# Altium schematic sheet Power Manangement.SchDoc
size A3; SheetNumber: 3; SheetTotal: 5
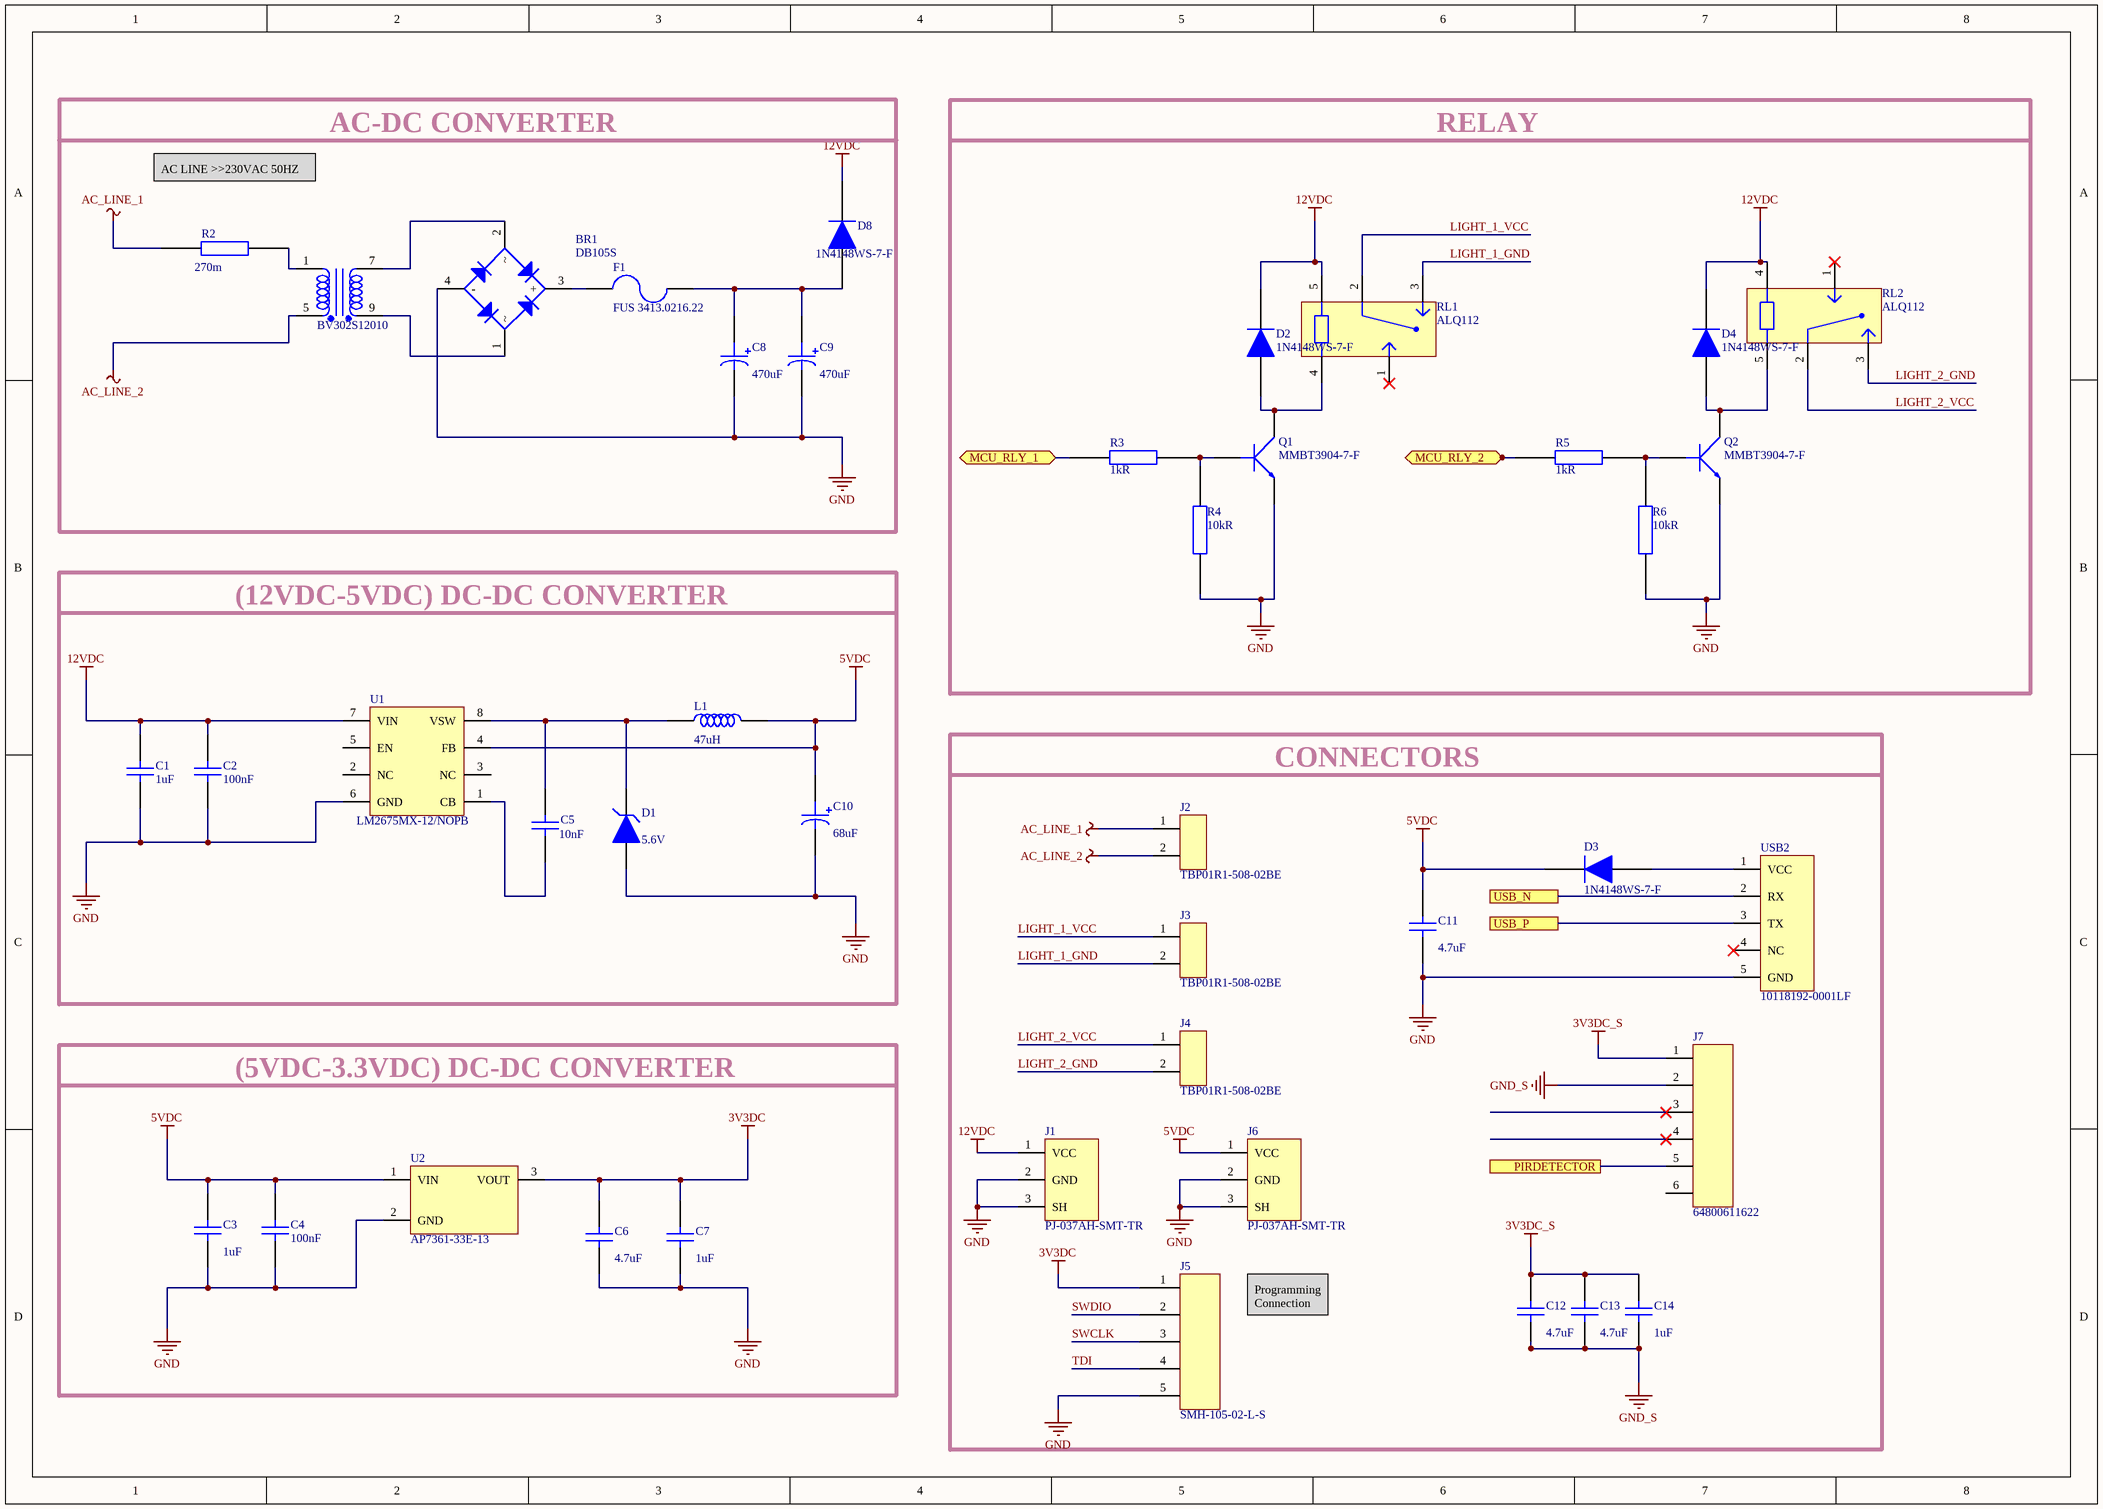
[diagram p0: Power Manangement.SchDoc]

## Parts
?  BV302S12010  [BV302S12010]
BR1  DB105S  [DB105S]
C1  value 1uF  [CAP_0805]  (hidden comment: CL21B105KBFNNNE)
C2  value 100nF  [CAP_0603]  (hidden comment: C0603C104K5RAC7867)
C3  value 1uF  [CAP_0805]  (hidden comment: CL21B105KBFNNNE)
C4  value 100nF  [CAP_0603]  (hidden comment: C0603C104K5RAC7867)
C5  Values: 10nF  [CAP_0603]  (hidden comment: 0603B103K160CT)
C6  value 4.7uF  [CAP_0805]  (hidden comment: CL21A475KAQNNNE)
C7  value 1uF  [CAP_0805]  (hidden comment: CL21B105KBFNNNE)
C8  Capacitance: 470uF  [CAP_RADIAL_D10_P5]  (hidden comment: ESH477M050AH4AA)
C9  Capacitance: 470uF  [CAP_RADIAL_D10_P5]  (hidden comment: ESH477M050AH4AA)
C10  Values: 68uF  [CAP_EEVSRIES]  (hidden comment: EEV686M035A9HAA)
C11  value 4.7uF  [CAP_0805]  (hidden comment: CL21A475KAQNNNE)
C12  value 4.7uF  [CAP_0805]  (hidden comment: CL21A475KAQNNNE)
C13  value 4.7uF  [CAP_0805]  (hidden comment: CL21A475KAQNNNE)
C14  value 1uF  [CAP_0805]  (hidden comment: CL21B105KBFNNNE)
D1  Voltage Rating (DC): 5.6V  [SMB]  (hidden comment: 1SMB5919BT3G)
D2  1N4148WS-7-F  [SOD323F]
D3  1N4148WS-7-F  [SOD323F]
D4  1N4148WS-7-F  [SOD323F]
D8  1N4148WS-7-F  [SOD323F]
F1  FUS 3413.0216.22  [FUS 3413.0216.22]
J1  PJ-037AH-SMT-TR  [JACK]
J2  TBP01R1-508-02BE  [TBP01R1-508]
J3  TBP01R1-508-02BE  [TBP01R1-508]
J4  TBP01R1-508-02BE  [TBP01R1-508]
J5  SMH-105-02-L-S  [INHEADER1X5_RA]
J6  PJ-037AH-SMT-TR  [JACK]
J7  64800611622
L1  value 47uH  [IND_1212]  (hidden comment: 78438335470)
Q1  MMBT3904-7-F  [SOT-23F]
Q2  MMBT3904-7-F  [SOT-23F]
R2  Resistance: 270m  [RES_AXIAL_W]  (hidden comment: 5WD27)
R3  value 1kR  [RES_0603]  (hidden comment: RC0603FR-0710KL)
R4  value 10kR  [RES_0603]  (hidden comment: RMCF0603JT10K0)
R5  value 1kR  [RES_0603]  (hidden comment: RC0603FR-0710KL)
R6  value 10kR  [RES_0603]  (hidden comment: RMCF0603JT10K0)
RL1  ALQ112  [ALQ112]
RL2  ALQ112  [ALQ112]
U1  LM2675MX-12/NOPB  [SOIC8]
U2  AP7361-33E-13  [SOT223]
USB2  10118192-0001LF  [MICRO_B_USB]

## Blocks framed on the sheet
RELAY: D2 D4 Q1 Q2 R3-R6 RL1 RL2
(12VDC-5VDC) DC-DC CONVERTER: C1 C2 C5 C10 D1 L1 U1
CONNECTORS: C11-C14 D3 J1-J7 USB2
(5VDC-3.3VDC) DC-DC CONVERTER: C3 C4 C6 C7 U2

## Ports
MCU_RLY_1 (bidir, see Microcontroller[3B]), MCU_RLY_2 (bidir, see Microcontroller[3B]), PIRDETECTOR (see Microcontroller[3B], Sensor Board[4B], Sensor Board[6A], Sensor Board[7A]), USB_N (see Microcontroller[4A]), USB_P (see Microcontroller[4A])

## Nets
3V3DC: C6.2 C7.1 J5.1 U2.3(VOUT)
3V3DC_S: C12.2 C13.2 C14.2 J7.1
5VDC: C3.1 C4.2 C10.1 C11.2 D3.1 J6.1(VCC) L1.2 U1.4(FB) U2.1(VIN)
12VDC: C1.1 C2.2 D2.1 D4.1 D8.1 J1.1(VCC) RL1.5 RL2.4 U1.7(VIN)
AC_LINE_1: J2.1 R2.1
AC_LINE_2: ?.5 J2.2
GND: BR1.4(-) C1.2 C2.1 C3.2 C4.1 C6.1 C7.2 C8.2 C9.2 C10.2 C11.1 D1.A J1.2(GND) J1.3(SH) J5.5 J6.2(GND) J6.3(SH) Q1.2(E) Q2.2(E) R4.1 R6.1 U1.6(GND) U2.2(GND) USB2.5(GND)
GND_S: C12.1 C13.1 C14.1 J7.2
LIGHT_1_GND: J3.2 RL1.3
LIGHT_1_VCC: J3.1 RL1.2
LIGHT_2_GND: J4.2 RL2.3
LIGHT_2_VCC: J4.1 RL2.2
MCU_RLY_1: R3.2 ; port MCU_RLY_1
MCU_RLY_2: R5.2 ; port MCU_RLY_2
PIRDETECTOR: J7.5 ; port PIRDETECTOR
SWCLK: J5.3
SWDIO: J5.2
TDI: J5.4
USB_N: USB2.2(RX) ; port USB_N
USB_P: USB2.3(TX) ; port USB_P
Net?_1: ?.1 R2.2
Net?_7: ?.7 BR1.2
Net?_9: ?.9 BR1.1
NetBR1_3: BR1.3(+) F1.1
NetC5_1: C5.1 U1.1(CB)
NetC5_2: C5.2 D1.C L1.1 U1.8(VSW)
NetC8_1: C8.1 C9.1 D8.2 F1.2
NetD2_2: D2.2 Q1.3(C) RL1.4
NetD3_2: D3.2 USB2.1(VCC)
NetD4_2: D4.2 Q2.3(C) RL2.5
NetQ1_1: Q1.1(B) R3.1 R4.2
NetQ2_1: Q2.1(B) R5.1 R6.2

Not connected (* = marked no-connect by the designer): J7 3* 4* 6; RL1 1*; RL2 1*; U1 2(NC) 3(NC) 5(EN); USB2 4(NC)*

## Notes on the sheet
- AC LINE >>230VAC 50HZ
- AC-DC CONVERTER
- Programming Connection

## Library data of the parts
? = BV302S12010: Sealed Transformer EI30/10.5; Manufacturer: Zettler Magnetics; Designed by: Selenay; Supplier: Digikey; Supplier Part Number: 3388-BV302S12010-ND; Manufacturer Part Number: BV302S12010; RoHS: No; Category: Uncategorized; Stock: 995; Pricing: 1=2,97, 15=2,37533, 30=1,93, 60=1,88067, 105=1,83114, 255=1,78165, 510=1,76678, 1005=1,56388, 5010=1,43521 (USD); RoHS Compliant: No
BR1 = DB105STR: Bridge Rect 1PHASE 600V 1A Db-s; Manufacturer: Sangdest Microelectronics; Designed by: Selenay; Supplier: Digikey; Supplier Part Number: 1655-DB105SCT-ND; Manufacturer Part Number: DB105S; RoHS: No; Category: Uncategorized; Stock: 12577; Pricing: 1=0,41, 10=0,29, 100=0,1464, 500=0,12978 (USD)
C1 C3 C7 C14 = CAP CER 1uF 0805: Multilayer Ceramic Capacitor, 1 uF, 50 V, ± 10%, X7R, 0805 [2012 Metric]; Manufacturer: Samsung; Voltage Rating (DC): 50V; Designed By: Selenay; Supplier: Digikey; Supplier Part Number: 1276-1029-1-ND; Manufacturer Part Number: CL21B105KBFNNNE; RoHS: Yes; Category: Ceramic Capacitors; Stock: 1263322; Pricing: 1=0,11, 10=0,075, 50=0,045, 100=0,0354, 500=0,02616, 1000=0,02165 (USD); Mounting Technology: Surface Mount; Case/Package: 0805; Material: Ceramic; Case Code (Metric): 2012; Case Code (Imperial): 0805; Min Operating Temperature: -55°C; Max Operating Temperature: 125°C; Tolerance: 10%; Packaging: Tape and Reel; Package Quantity: 1; Voltage Rating: 50V; Dielectric: X7R; Voltage: 50V; Series: CL; Construction: Flat; Length: 2mm; Width: 0.049inch; Height: 1.25mm; Thickness: 0.053inch; Depth: 1.25mm; Radiation Hardening: No; RoHS Compliant: Yes; ComponentLink1URL: https://datasheet.ciiva.com/25800/cl21b105kbfnnne-25800291.pdf?src-supplier=Digikey; ComponentLink1Description: https://datasheet.ciiva.com/25800/cl21b105kbfnnne-25800291.pdf?src-supplier=Digikey
C2 C4 = CAP CER 100nF 0603: Multilayer Ceramic Capacitor, 0.1 uF, 50 V, ± 10%, X7R, 0603 [1608 Metric]; Manufacturer: KEMET; Manufacturer Part Number: C0603C104K5RACTU; Designed by: Selenay; Material: 4241ConductorMaterial; Voltage Rating: 50V; Temperature Coefficient: 30ppm/°C; Supplier: Digikey; Supplier Part Number: 399-C0603C104K5RAC7867CT-ND; RoHS: Yes; Category: Ceramic Capacitors; Stock: 2150274; Pricing: 1=0,11, 10=0,074, 50=0,0424, 100=0,0329, 500=0,02474, 1000=0,01944 (USD); Mounting Technology: Surface Mount; Case/Package: 0603; Min Operating Temperature: -55°C; Max Operating Temperature: 125°C; Tolerance: 10%; Dielectric: X7R; Packaging: Tape and Reel; Voltage: 50V; Series: SMD Comm X7R; Length: 0.063inch; Width: 0.031inch; Thickness: 0.034inch; RoHS Compliant: Yes; Lead Free: 5697LeadFree
C5 = CAP CER 10nF 0603: 0603 16V X7R .01uF 10% multilayer ceramic capacitor; Manufacturer: Walsin Technologies; Designed By: Selenay; Supplier: Digikey; Supplier Part Number: 1292-1384-1-ND; Manufacturer Part Number: 0603B103K160CT; RoHS: Yes; Category: Ceramic Capacitors; Stock: 66698; Pricing: 1=0,1, 10=0,031, 50=0,018, 100=0,0139, 500=0,0105, 1000=0,00825 (USD); Lead Free: 5697LeadFree; ComponentLink1URL: http://www.farnell.com/datasheets/1958513.pdf?src-supplier=Farnell; ComponentLink1Description: http://www.farnell.com/datasheets/1958513.pdf?src-supplier=Farnell; ComponentLink2URL: https://datasheet.octopart.com/0603B103K160CT-Walsin-Technologies-datasheet-136037192.pdf?src-supplier=Future+Electronics; ComponentLink2Description: https://datasheet.octopart.com/0603B103K160CT-Walsin-Technologies-datasheet-136037192.pdf?src-supplier=Future+Electronics; ComponentLink3URL: http://www.passivecomponent.com/wp-content/uploads/2018/10/MLCC.pdf?src-supplier=Digikey; ComponentLink3Description: http://www.passivecomponent.com/wp-content/uploads/2018/10/MLCC.pdf?src-supplier=Digikey; ComponentLink4URL: https://datasheet.octopart.com/0603B103K160CT-Walsin-Technologies-datasheet-85392065.pdf?src-supplier=Element14; ComponentLink4Description: https://datasheet.octopart.com/0603B103K160CT-Walsin-Technologies-datasheet-85392065.pdf?src-supplier=Element14; ComponentLink5URL: https://datasheet.octopart.com/0603B103K160CT-Walsin-Technologies-datasheet-62066062.pdf?src-supplier=TME; ComponentLink5Description: https://datasheet.octopart.com/0603B103K160CT-Walsin-Technologies-datasheet-62066062.pdf?src-supplier=TME
C6 C11-C13 = CAP CER 4.7uF 0805: Multilayer Ceramic Capacitor, 4.7 uF, 25 V, ± 10%; Manufacturer: Samsung; Voltage Rating: 25V; Dielectric: X5R; Designed By: Selenay; Supplier: Digikey; Supplier Part Number: 1276-1244-1-ND; Manufacturer Part Number: CL21A475KAQNNNE; RoHS: Yes; Category: Ceramic Capacitors; Stock: 3215685; Pricing: 1=0,1, 10=0,069, 50=0,0414, 100=0,0326, 500=0,02408, 1000=0,01994 (USD); Mounting Technology: Surface Mount; Case/Package: 0805; Case Code (Metric): 2012; Case Code (Imperial): 0805; Material: Ceramic; Min Operating Temperature: -55°C; Max Operating Temperature: 85°C; Packaging: Tape and Reel; Tolerance: 10%; Voltage Rating (DC): 25V; Series: CL; Construction: Flat; Length: 2mm; Height: 1.25mm; Depth: 1.25mm; Radiation Hardening: No; Lead Free: Lead Free; RoHS Compliant: Yes; ComponentLink1URL: https://datasheet.ciiva.com/25798/cl21a475kaqnnne-25798882.pdf?src-supplier=Digikey; ComponentLink1Description: https://datasheet.ciiva.com/25798/cl21a475kaqnnne-25798882.pdf?src-supplier=Digikey
C8 C9 = ESH477M050AH4AA: Radial Electrolytic Aluminium Capacitor, 470uF, 50VDC, 20%; Manufacturer: KEMET; Voltage Rating (DC): 50V; Designed By: Selenay; Supplier: Digikey; Supplier Part Number: 399-15683-ND; Manufacturer Part Number: ESH477M050AH4AA; RoHS: Yes; Category: LDO; Stock: 10333; Pricing: 1=0,64, 10=0,432, 200=0,28415, 1000=0,1887, 5000=0,1665, 10000=0,1554 (USD); Diameter: 10mm; Height: 20mm; ComponentLink1URL: https://api.kemet.com/component-edge/download/datasheet/ESH477M050AH4AA.pdf?src-supplier=Digikey; ComponentLink1Description: https://api.kemet.com/component-edge/download/datasheet/ESH477M050AH4AA.pdf?src-supplier=Digikey; ComponentLink2URL: https://datasheet.octopart.com/ESH477M050AH4AA-KEMET-datasheet-130075338.pdf?src-supplier=Newark; ComponentLink2Description: https://datasheet.octopart.com/ESH477M050AH4AA-KEMET-datasheet-130075338.pdf?src-supplier=Newark
C10 = CAP ALU 68uF: Cap Aluminum Lytic 68uF 35V 20%( 6.3 X 7.7mm) SMD 0.34 Ohm 280mA 2000h 105C T/R; Manufacturer: KEMET; Designed By: Selenay; Supplier: Digikey; Supplier Part Number: 399-6722-1-ND; Manufacturer Part Number: EEV686M035A9HAA; RoHS: Yes; Category: Aluminum Electrolytic Capacitors; Stock: 22810; Pricing: 1=0,41, 10=0,277, 50=0,2204, 100=0,1819, 500=0,14214 (USD); ComponentLink1URL: https://datasheet.ciiva.com/5365/kem-a4002-eev-535332-5365784.pdf?src-supplier=Mouser; ComponentLink1Description: https://datasheet.ciiva.com/5365/kem-a4002-eev-535332-5365784.pdf?src-supplier=Mouser
D1 = 1SMB5919BT3G: Diode Zener Single 5.6V 5% 550mW Automotive 2-Pin SMB T/R; Manufacturer: ON Semiconductor; Material: 4239ConductorMaterial; Breakdown Voltage: 5.88V; Power Rating: 3W; Designed By: Selenay; Supplier: Digikey; Supplier Part Number: 1SMB5919BT3GOSCT-ND; Manufacturer Part Number: 1SMB5919BT3G; RoHS: Yes; Category: Zener Diodes; Stock: 17150; Pricing: 1=0,48, 10=0,341, 100=0,1722, 500=0,15262, 1000=0,11878 (USD); Lead Free: 5697LeadFree; Halogen Free: 5694HalogenFree; ComponentLink1URL: https://datasheet.ciiva.com/27747/1308331-27747654.pdf?src-supplier=Jameco; ComponentLink1Description: https://datasheet.ciiva.com/27747/1308331-27747654.pdf?src-supplier=Jameco; ComponentLink2URL: https://datasheet.ciiva.com/1182/1smb5913bt3-d-1182657.pdf?src-supplier=Element14; ComponentLink2Description: https://datasheet.ciiva.com/1182/1smb5913bt3-d-1182657.pdf?src-supplier=Element14; ComponentLink3URL: https://datasheet.ciiva.com/1182/1smb5913bt3-d-1182658.pdf?src-supplier=Element14; ComponentLink3Description: https://datasheet.ciiva.com/1182/1smb5913bt3-d-1182658.pdf?src-supplier=Element14; ComponentLink4URL: https://datasheet.ciiva.com/895/1smb5913bt3-d-895203.pdf?src-supplier=Digikey; ComponentLink4Description: https://datasheet.ciiva.com/895/1smb5913bt3-d-895203.pdf?src-supplier=Digikey; ComponentLink5URL: https://datasheet.ciiva.com/895/1smb5913bt3-d-895204.pdf?src-supplier=Digikey; ComponentLink5Description: https://datasheet.ciiva.com/895/1smb5913bt3-d-895204.pdf?src-supplier=Digikey; ComponentLink6URL: https://datasheet.ciiva.com/895/1smb5913bt3-d-895205.pdf?src-supplier=Digikey; ComponentLink6Description: https://datasheet.ciiva.com/895/1smb5913bt3-d-895205.pdf?src-supplier=Digikey; ComponentLink7URL: https://datasheet.ciiva.com/15198/getdatasheetpartid-311040-15198695.pdf?src-supplier=Verical; ComponentLink7Description: https://datasheet.ciiva.com/15198/getdatasheetpartid-311040-15198695.pdf?src-supplier=Verical; ComponentLink8URL: https://datasheet.ciiva.com/16311/1smb5913bt3-d-16311847.pdf?src-supplier=Future+Electronics; ComponentLink8Description: https://datasheet.ciiva.com/16311/1smb5913bt3-d-16311847.pdf?src-supplier=Future+Electronics
D2-D4 D8 = 1N4148WS: Small Signal Diode, 100V, SOD-323; Manufacturer: Diodes; Forward Current: 300mA; Max Repetitive Reverse Voltage (Vrrm): 75V; Max Reverse Current: 1uA; Reverse Recovery Time: 4ns; Peak Non-Repetitive Surge Current: 2A; Forward Voltage: 1.25V; Average Rectified Current: 150mA; Power Dissipation: 200mW; Polarity: Standard; Value: 2pF; Supplier: Digikey; Supplier Part Number: 1N4148WS-FDICT-ND; Manufacturer Part Number: 1N4148WS-7-F; RoHS: Yes; Category: LDO; Stock: 131688; Pricing: 1=0,17, 10=0,121, 100=0,0652, 500=0,05122, 1000=0,03557 (USD); Mounting Technology: Surface Mount; Pins: 2; Weight: 0.000173oz; Min Operating Temperature: -65°C; Max Operating Temperature: 150°C; Max Forward Surge Current (Ifsm): 2A; Max Surge Current: 2A; Packaging: Tape and Reel; Recovery Time: 4ns; Package Quantity: 3000; Voltage Rating (DC): 75V; Power Rating: 200mW; Current Rating: 150mA; Output Current: 150mA; Voltage: 75V; Max Reverse Voltage (DC): 75V; Series: -; Reverse Recovery Time-Max: 4ns; Length: 1.8mm; Width: 1.4mm; Height: 1mm; Radiation Hardening: No; Reach SVHC Compliant: No; Lead Free: Lead Free; RoHS Compliant: Yes; ComponentLink1URL: https://datasheet.ciiva.com/1179/ds30097-1179355.pdf?src-supplier=Element14; ComponentLink1Description: https://datasheet.ciiva.com/1179/ds30097-1179355.pdf?src-supplier=Element14; ComponentLink2URL: https://datasheet.ciiva.com/8300/ds30097-8300396.pdf?src-supplier=Avnet; ComponentLink2Description: https://datasheet.ciiva.com/8300/ds30097-8300396.pdf?src-supplier=Avnet; ComponentLink3URL: https://datasheet.ciiva.com/16199/ds30097-16199061.pdf?src-supplier=Future+Electronics; ComponentLink3Description: https://datasheet.ciiva.com/16199/ds30097-16199061.pdf?src-supplier=Future+Electronics; ComponentLink4URL: https://datasheet.ciiva.com/911/ds30097-911742.pdf?src-supplier=Digikey; ComponentLink4Description: https://datasheet.ciiva.com/911/ds30097-911742.pdf?src-supplier=Digikey; ComponentLink5URL: https://datasheet.ciiva.com/911/ds30097-911743.pdf?src-supplier=Digikey; ComponentLink5Description: https://datasheet.ciiva.com/911/ds30097-911743.pdf?src-supplier=Digikey; ComponentLink6URL: https://datasheet.ciiva.com/911/ds30097-911741.pdf?src-supplier=Digikey; ComponentLink6Description: https://datasheet.ciiva.com/911/ds30097-911741.pdf?src-supplier=Digikey
F1 = FUS 3413.0216.22: Fuse Chip Fast Acting 1A 32V SMD Solder Pad 1206 Glass T/R VDE/cULus; Manufacturer: Schurter; Body Material: Glass,Epoxy; Voltage Rating (DC): 63V; DC Cold Resistance: 94.2mR; Fuse Type: Board Mount (Cartridge Style Excluded); Approvals: VDE,cURus; Designed By: Selenay; Supplier: Digikey; Supplier Part Number: 486-1144-1-ND; Manufacturer Part Number: 3413.0216.22; RoHS: Yes; Category: Fuses; Stock: 16695; Pricing: 1=0,67, 50=0,524, 100=0,397, 500=0,345 (USD); Mounting Technology: Surface Mount,PCB; Case/Package: 1206; Pins: 2; Weight: 0.000212oz; Case Code (Metric): 3216; Case Code (Imperial): 1206; Contact Plating: Gold; Terminal Material: Tin; Min Operating Temperature: -55°C; Max Operating Temperature: 90°C; Current Rating: 1A; Package Quantity: 1000; Voltage Rating (AC): 32V; Packaging: Tape and Reel; Voltage Rating: 32V; Termination: SMD/SMT; Working Voltage: 32V; Series: USI 1206; Length: 3.2mm; Width: 1.6mm; Height: 0.6mm; Lead Free: Lead Free; RoHS Compliant: Yes; ComponentLink1URL: https://datasheet.ciiva.com/301/typ-usi-1206-301440.pdf?src-supplier=Digikey; ComponentLink1Description: https://datasheet.ciiva.com/301/typ-usi-1206-301440.pdf?src-supplier=Digikey; ComponentLink2URL: https://datasheet.ciiva.com/8264/typ-usi-1206-8264583.pdf?src-supplier=Avnet; ComponentLink2Description: https://datasheet.ciiva.com/8264/typ-usi-1206-8264583.pdf?src-supplier=Avnet; ComponentLink3URL: https://datasheet.ciiva.com/16316/typ-usi-1206-16316588.pdf?src-supplier=Future+Electronics; ComponentLink3Description: https://datasheet.ciiva.com/16316/typ-usi-1206-16316588.pdf?src-supplier=Future+Electronics; ComponentLink4URL: https://datasheet.ciiva.com/301/typ-usi-1206-301439.pdf?src-supplier=Digikey; ComponentLink4Description: https://datasheet.ciiva.com/301/typ-usi-1206-301439.pdf?src-supplier=Digikey; ComponentLink5URL: https://datasheet.ciiva.com/14541/70160006-14541114.pdf?src-supplier=Allied+Electronics; ComponentLink5Description: https://datasheet.ciiva.com/14541/70160006-14541114.pdf?src-supplier=Allied+Electronics; ComponentLink6URL: https://datasheet.ciiva.com/14102/qousi1206-data-e-14102903.pdf?src-supplier=Distrelec; ComponentLink6Description: https://datasheet.ciiva.com/14102/qousi1206-data-e-14102903.pdf?src-supplier=Distrelec; ComponentLink7URL: https://datasheet.ciiva.com/301/typ-usi-1206-301441.pdf?src-supplier=Digikey; ComponentLink7Description: https://datasheet.ciiva.com/301/typ-usi-1206-301441.pdf?src-supplier=Digikey
J1 J6 = PJ-037AH-SMT-TR: 2.0 x 6.3 mm, 5.0 A, Horizontal, Surface Mount (SMT), Dc Power Jack Connector; Manufacturer: CUI; Designed By: Selenay; Number of Conductors: 2; Gender: Male; Shielding: Unshielded; Current Rating: 5A; Voltage Rating: 24V; Insulation Resistance: 100MR; Supplier: Digikey; Supplier Part Number: CP-037AHPJCT-ND; Manufacturer Part Number: PJ-037AH-SMT-TR; RoHS: Yes; Category: Uncategorized; Mounting Technology: Surface Mount,Through Hole; Case/Package: SMD/SMT; Color: Black; Contact Material: Copper; Contact Plating: Nickel; Housing Color: Black; Housing Material: Thermoplastic; Min Operating Temperature: -25°C; Max Operating Temperature: 85°C; Orientation: Horizontal; Package Quantity: 200; Termination: Solder; Connector Type: Jack; Contact Gender: Male; Packaging: Tape and Reel; Flammability Rating: UL94 V-0; ComponentLink1URL: http://www.mouser.com/ds/2/670/pj-037ah-smt-516065.pdf?src-supplier=Mouser; ComponentLink1Description: http://www.mouser.com/ds/2/670/pj-037ah-smt-516065.pdf?src-supplier=Mouser; ComponentLink2URL: https://www.cui.com/product/resource/digikeypdf/pj-037ah-smt-tr.pdf?src-supplier=Digikey; ComponentLink2Description: https://www.cui.com/product/resource/digikeypdf/pj-037ah-smt-tr.pdf?src-supplier=Digikey; ComponentLink3URL: http://www.cui.com/product/resource/digikeypdf/pj-037ah-smt.pdf?src-supplier=Digikey; ComponentLink3Description: http://www.cui.com/product/resource/digikeypdf/pj-037ah-smt.pdf?src-supplier=Digikey
J2-J4 = TBP01R1-508-02BE: 2~24 Poles, Pluggable, Receptacle, Horizontal, 5.08 Pitch, Terminal Block Connector; Manufacturer: CUI Devices; Designed By: Selenay; Supplier: Digikey; Supplier Part Number: 102-6406-ND; Manufacturer Part Number: TBP01R1-508-02BE; RoHS: Yes; Category: Terminal Blocks; Stock: 97948; Pricing: 1=0,33, 10=0,176, 25=0,1244, 50=0,1058, 100=0,1022, 400=0,08638, 800=0,0743, 1200=0,07058, 5200=0,0654 (USD); ComponentLink1URL: https://www.cuidevices.com/product/resource/digikeypdf/tbp01r1-508.pdf?src-supplier=Digikey; ComponentLink1Description: https://www.cuidevices.com/product/resource/digikeypdf/tbp01r1-508.pdf?src-supplier=Digikey; ComponentLink2URL: https://datasheet.octopart.com/TBP01R1-508-02BE-CUI-Devices-datasheet-147843976.pdf?src-supplier=Future+Electronics; ComponentLink2Description: https://datasheet.octopart.com/TBP01R1-508-02BE-CUI-Devices-datasheet-147843976.pdf?src-supplier=Future+Electronics; ComponentLink3URL: https://datasheet.octopart.com/TBP01R1-508-02BE-CUI-Devices-datasheet-154730754.pdf?src-supplier=Electro+Sonic; ComponentLink3Description: https://datasheet.octopart.com/TBP01R1-508-02BE-CUI-Devices-datasheet-154730754.pdf?src-supplier=Electro+Sonic
J5 = SMH-105-02-L-S: PCB Receptacle, Board-to-Board, 2.54 mm, 1 Rows, 5 Contacts, Surface Mount, SMH; Manufacturer: Samtec; Designed By: Selenay; Number of Contacts: 5; Pitch: 2.54mm; Supplier: Digikey; Supplier Part Number: SAM11813-ND; Manufacturer Part Number: SMH-105-02-L-S; RoHS: Yes; Category: Connectors; Stock: 2; Pricing: 1=2,01, 50=1,56, 100=1,26, 500=1,07, 1000=1 (USD); Contact Plating: Gold; Contact Material: Bronze; Contact Finish - Mating: GOLD; Insulation Color: Black; Insulation Material: Polymer; Contact Shape: Square; Min Operating Temperature: -55°C; Max Operating Temperature: 125°C; Packaging: Rail/Tube; Number of Rows: 1; Termination: Solder; Gender: Receptacle; Orientation: Horizontal; Connector Type: Receptacle; Fastening Type: Pull; Series: SMH; Contact Type: Forked; Number of Positions: 5; Radiation Hardening: No; RoHS Compliant: Yes; Reach SVHC Compliant: No; Flammability Rating: UL94 V-0; ComponentLink1URL: http://www.farnell.com/datasheets/1927708.pdf?_ga=2.237598468.569325269.1503285096-1413671594.1503025027&src-supplier=Farnell; ComponentLink1Description: http://www.farnell.com/datasheets/1927708.pdf?_ga=2.237598468.569325269.1503285096-1413671594.1503025027&src-supplier=Farnell; ComponentLink2URL: http://www.samtec.com/documents/webfiles/pdf/SMH.PDF?src-supplier=Newark; ComponentLink2Description: http://www.samtec.com/documents/webfiles/pdf/SMH.PDF?src-supplier=Newark; ComponentLink3URL: http://www.samtec.com/documents/webfiles/pdf/SMH.PDF?src-supplier=Avnet; ComponentLink3Description: http://www.samtec.com/documents/webfiles/pdf/SMH.PDF?src-supplier=Avnet; ComponentLink4URL: http://suddendocs.samtec.com/catalog_english/smh.pdf?src-supplier=Digikey; ComponentLink4Description: http://suddendocs.samtec.com/catalog_english/smh.pdf?src-supplier=Digikey
J7 = 64800611622_CONN_6PIN: WR-WTB Wire-to-Board Connectors 1.50 mm; Manufacturer: Wurth Electronics; Supplier: Digikey; Supplier Part Number: 732-64800611622-ND; Manufacturer Part Number: 64800611622; RoHS: No; Category: Uncategorized; Stock: 1308; Pricing: 1=0,41, 50=0,406, 100=0,384, 250=0,361, 500=0,339 (USD)
L1 = IND 47uH: Power Inductor, Aec-Q200, 47Uh, 0.39A Rohs Compliant: Yes |Wurth Elektronik 78438335470; Manufacturer: Wurth Electronics; Designed By: Selenay; Core Material: Ferrite; Current Rating: 390mA; Saturation Current: 1.18A; Shielding: Shielded; DC Resistance (DCR): 2.3R; Self Resonant Frequency: 8MHz; Test Frequency: 100kHz; Tolerance: 30%; Supplier: Digikey; Supplier Part Number: 732-6947-1-ND; Manufacturer Part Number: 78438335470; RoHS: Yes; Category: Fixed Inductors; Stock: 5684; Pricing: 1=2,11, 50=1,97, 250=1,803, 500=1,672 (USD); Mounting Technology: Surface Mount; Case/Package: 1212; Case Code (Metric): 3030; Case Code (Imperial): 1212; Min Operating Temperature: -40°C; Max Operating Temperature: 125°C; Packaging: Cut Tape; Series: WE-MAIA; Length: 0.118inch; Width: 0.118inch; Height - Seated (Max): 0.059inch; Ratings: AEC-Q200; RoHS Compliant: Yes; ComponentLink1URL: https://media.digikey.com/pdf/Data%20Sheets/Wurth%20Electronics%20PDFs/Q+_Products_Flyer.pdf?src-supplier=Digikey; ComponentLink1Description: https://media.digikey.com/pdf/Data%20Sheets/Wurth%20Electronics%20PDFs/Q+_Products_Flyer.pdf?src-supplier=Digikey
Q1 Q2 = MMBT3904-7-F: Transistor General Purpose BJT NPN 40 Volt 0.2A Automotive 3-Pin SOT-23; Manufacturer: Diodes Zetex; Designed By: Selenay; Max Power Dissipation: 300mW; Collector Emitter Voltage (VCEO): 40V; Max Collector Current: 200mA; Collector Base Voltage (VCBO): 60V; Power Dissipation: 350mW; Frequency: 300MHz; hFE Min: 100; Number of Elements: 1; Emitter Base Voltage (VEBO): 6V; Collector Emitter Saturation Voltage: 300mV; Supplier: Digikey; Supplier Part Number: MMBT3904-FDICT-ND; Manufacturer Part Number: MMBT3904-7-F; RoHS: Yes; Category: BJTs; Stock: 4398181; Pricing: 1=0,12, 10=0,086, 100=0,0467, 500=0,03666, 1000=0,02545 (USD); Mounting Technology: Surface Mount; Case/Package: SOT-23; Pins: 3; Weight: 0.000282oz; Min Operating Temperature: -55°C; Max Operating Temperature: 150°C; Polarity: NPN; Packaging: Tape and Reel; Voltage Rating (DC): 40V; Package Quantity: 3000; Transition Frequency: 300MHz; Collector Emitter Breakdown Voltage: 40V; Max Breakdown Voltage: 40V; Continuous Collector Current: 200mA; Clock Frequency: 300MHz; Gain Bandwidth Product: 300MHz; Series: Automotive, AEC-Q101; Collector-emitter Voltage-Max: 300mV; Length: 3.05mm; Width: 1.4mm; Height: 1mm; Radiation Hardening: No; Reach SVHC Compliant: No; Lead Free: Lead Free; RoHS Compliant: Yes; ComponentLink1URL: https://datasheet.ciiva.com/11201/ds30036-11201778.pdf?src-supplier=Avnet; ComponentLink1Description: https://datasheet.ciiva.com/11201/ds30036-11201778.pdf?src-supplier=Avnet; ComponentLink2URL: https://datasheet.ciiva.com/15138/getdatasheetpartid-53265-15138780.pdf?src-supplier=Verical; ComponentLink2Description: https://datasheet.ciiva.com/15138/getdatasheetpartid-53265-15138780.pdf?src-supplier=Verical; ComponentLink3URL: https://datasheet.ciiva.com/22711/1915516-22711750.pdf?src-supplier=Element14; ComponentLink3Description: https://datasheet.ciiva.com/22711/1915516-22711750.pdf?src-supplier=Element14; ComponentLink4URL: https://datasheet.ciiva.com/11198/ds30036-11198999.pdf?src-supplier=Avnet; ComponentLink4Description: https://datasheet.ciiva.com/11198/ds30036-11198999.pdf?src-supplier=Avnet; ComponentLink5URL: https://datasheet.ciiva.com/6361/ds30036-6361256.pdf?src-supplier=Digikey; ComponentLink5Description: https://datasheet.ciiva.com/6361/ds30036-6361256.pdf?src-supplier=Digikey; ComponentLink6URL: https://datasheet.ciiva.com/6361/ds30036-6361254.pdf?src-supplier=Digikey; ComponentLink6Description: https://datasheet.ciiva.com/6361/ds30036-6361254.pdf?src-supplier=Digikey
R2 = 5WD27: RES 0.27 OHM 5% 5W AXIAL
R3 R5 = RES 1K OHM 0603: SMD Chip Resistor, 1 kOhm, ± 1%, 100 mW, 0603 [1608 Metric], Thick Film, General Purpose; Manufacturer: Yageo; Manufacturer Part Number: RC0603FR-071KL; Designed by: Selenay; Temperature Coefficient: 100ppm/°C; Power Rating: 100mW; Voltage Rating: 50V; Supplier: Digikey; Supplier Part Number: 311-1.00KHRCT-ND; RoHS: Yes; Category: Chip SMD Resistors; Stock: 14334502; Pricing: 1=0,1, 10=0,019, 50=0,0112, 100=0,0093, 500=0,00622, 1000=0,00532 (USD); Case/Package: 0603; Contact Plating: Tin,Matte; Case Code (Imperial): 0603; Case Code (Metric): 1608; Min Operating Temperature: -55°C; Max Operating Temperature: 155°C; Tolerance: 1%; Packaging: Tape and Reel; Resistor Type: Thick Film; Termination: SMD/SMT; Features: Moisture Resistant; Series: RC; Max Power Dissipation: 100mW; Number of Terminations: 2; Resistance Tolerance: 1%; Construction: Rectangular; Technology: THICK FILM; Length: 1.6mm; Height: 0.45mm; Depth: 0.8mm; Reach SVHC Compliant: No; Lead Free: 5697LeadFree; Military Standard: Not; RoHS Compliant: Yes
R4 R6 = RES 10K OHM 0603: Res Thick Film 0603 10K Ohm 5% 1/10W ±100ppm/°C Molded SMD SMD Paper T/R; Manufacturer: Stackpole Electronics; Designed By: Selenay; Supplier: Digikey; Supplier Part Number: RMCF0603JT10K0CT-ND; Manufacturer Part Number: RMCF0603JT10K0; RoHS: Yes; Category: Chip SMD Resistors; Stock: 14399484; Pricing: 1=0,1, 10=0,021, 50=0,0116, 100=0,0093, 500=0,00594, 1000=0,005 (USD); ComponentLink1URL: https://datasheet.ciiva.com/15193/getdatasheetpartid-364254-15193501.pdf?src-supplier=Verical; ComponentLink1Description: https://datasheet.ciiva.com/15193/getdatasheetpartid-364254-15193501.pdf?src-supplier=Verical
RL1 RL2 = ALQ112: Electromechanical Relay 12VDC 360Ohm 10(NO)/3(NC)A SPDT (( 20mm 10mm 16mm)) THT Power Relay; Manufacturer: Panasonic; Designed by: Selenay; Supplier: Digikey; Supplier Part Number: 255-3562-ND; Manufacturer Part Number: ALQ112; RoHS: Yes; Category: Power Relays; Stock: 35498; Pricing: 1=1,28, 10=1,204, 25=1,0704, 50=1,017, 100=0,9635, 300=0,85647, 500=0,80296, 1000=0,74942, 5000=0,72266 (USD); ComponentLink1URL: https://datasheet.ciiva.com/24388/307ds-61b20-en-lq-24388909.pdf?src-supplier=Onlinecomponents.com; ComponentLink1Description: https://datasheet.ciiva.com/24388/307ds-61b20-en-lq-24388909.pdf?src-supplier=Onlinecomponents.com; Case/Package: ALQ112
U1 = LM2675MX-12: SIMPLE SWITCHER® 6.5V to 40V, 1A Low Component Count Step-Down Regulator 8-SOIC -40 to 125; Manufacturer: TI National Semiconductor; Number of Outputs: 1; Output Voltage: 12V; Efficiency: 94%; Min Input Voltage: 8V; Switching Frequency: 260kHz; Quiescent Current: 2.5mA; Output Type: Fixed; Designed by: Selenay; Supplier: Digikey; Supplier Part Number: 296-35410-6-ND; Manufacturer Part Number: LM2675MX-12/NOPB; RoHS: Yes; Category: Voltage Regulators - Switching; Stock: 3258; Pricing: 1=4,71, 10=4,231, 25=3,9996, 100=3,4663, 250=3,28856, 500=2,95082, 1000=2,48864 (USD); Mounting Technology: Surface Mount; Case/Package: SOIC N; Pins: 8; Min Operating Temperature: -40°C; Max Operating Temperature: 125°C; Output Current: 1A; Packaging: Tape and Reel; Max Output current: 1A; Max Supply Voltage: 40V; Package Quantity: 2500; Operating Supply Voltage: 40V; Series: LM2675; Radiation Hardening: No; Lead Free: Lead Free; RoHS Compliant: Yes; ComponentLink1URL: https://datasheet.ciiva.com/41457/001013881-da-01-en-ic-reg-buck-lm2675mx-12-nopb-soic-8-tid-41457896.pdf?src-supplier=Conrad; ComponentLink1Description: https://datasheet.ciiva.com/41457/001013881-da-01-en-ic-reg-buck-lm2675mx-12-nopb-soic-8-tid-41457896.pdf?src-supplier=Conrad; ComponentLink2URL: https://datasheet.ciiva.com/3220/lm2675-3220840.pdf?src-supplier=Avnet; ComponentLink2Description: https://datasheet.ciiva.com/3220/lm2675-3220840.pdf?src-supplier=Avnet
U2 = AP7361-33E-13: AP7361 Series 3.3 V 1 A Low SMT Dropout Fixed-Mode Regulator - SOT-223; Manufacturer: Diodes; Designed by: Selenay; Number of Outputs: 1; Min Input Voltage: 2.2V; Max Supply Voltage: 6V; Max Output current: 1A; Output Voltage: 3.3V; Max Power Dissipation: 1.1W; Dropout Voltage: 500mV; Min Current Limit: 1.1A; Polarity: Positive; Quiescent Current: 70uA; Power Dissipation: 1.1kW; Accuracy: 1%; Power Supply Rejection Ratio (PSRR): 65dB; Reference Voltage: 800mV; Output Type: Fixed; Supplier: Digikey; Supplier Part Number: AP7361-33E-13DICT-ND; Manufacturer Part Number: AP7361-33E-13; RoHS: Yes; Category: Voltage Regulators - Linear; Stock: 116886; Pricing: 1=0,51, 10=0,414, 25=0,3788, 100=0,2818, 250=0,2554, 500=0,21138, 1000=0,15853 (USD); Mounting Technology: Surface Mount; Case/Package: SOT-223; Pins: 4; Weight: 0.000282oz; Contact Plating: Tin,Matte; Min Operating Temperature: -40°C; Max Operating Temperature: 85°C; Package Quantity: 1; Packaging: Tape and Reel; Output Current: 1A; Number of Regulators: 1; Series: -; Radiation Hardening: No; Reach SVHC Compliant: Yes; Lead Free: Lead Free; RoHS Compliant: Yes; ComponentLink1URL: https://datasheet.ciiva.com/26926/getdatasheetpartid-670786-26926141.pdf?src-supplier=Verical; ComponentLink1Description: https://datasheet.ciiva.com/26926/getdatasheetpartid-670786-26926141.pdf?src-supplier=Verical; ComponentLink2URL: https://datasheet.ciiva.com/29568/ap7361-29568378.pdf?src-supplier=Digikey; ComponentLink2Description: https://datasheet.ciiva.com/29568/ap7361-29568378.pdf?src-supplier=Digikey
USB2 = Micro B USB Connector: CONN USB MICRO B RECPT SMT R/A; Manufacturer: Amphenol ICC / FCI; Gender: Receptacle; Connector Type: USB,Receptacle; USB Standard: USB 2.0; Number of Contacts: 5; Current Rating: 1.8A; Insulation Resistance: 1GR; Max Voltage Rating (AC): 100V; Number of Ports: 1; Pitch: 0.65mm; Supplier: Digikey; Supplier Part Number: 609-4613-1-ND; Manufacturer Part Number: 10118192-0001LF; RoHS: No; Category: Uncategorized; Stock: 57017; Pricing: 1=0,46, 10=0,404, 25=0,3696, 50=0,3478, 100=0,3334, 250=0,30436, 500=0,28988 (USD); Mounting Technology: Surface Mount,Horizontal; Pins: 5; Color: Black; Contact Material: Copper Alloy; Contact Plating: Gold; Housing Material: Polymer; Min Operating Temperature: -55°C; Max Operating Temperature: 85°C; Features: Shielded; Termination: Solder; Orientation: Right Angle; Voltage Rating: 100V; Series: -; Packaging: Tape and Reel; Package Quantity: 1400; Length: 7.86mm; Depth: 5.57mm; Radiation Hardening: No; Flammability Rating: UL94 V-0; Reach SVHC Compliant: No